# Altium schematic sheet LDO.SchDoc
size 381 x 241 mm; SheetNumber: 2; SheetTotal: 6
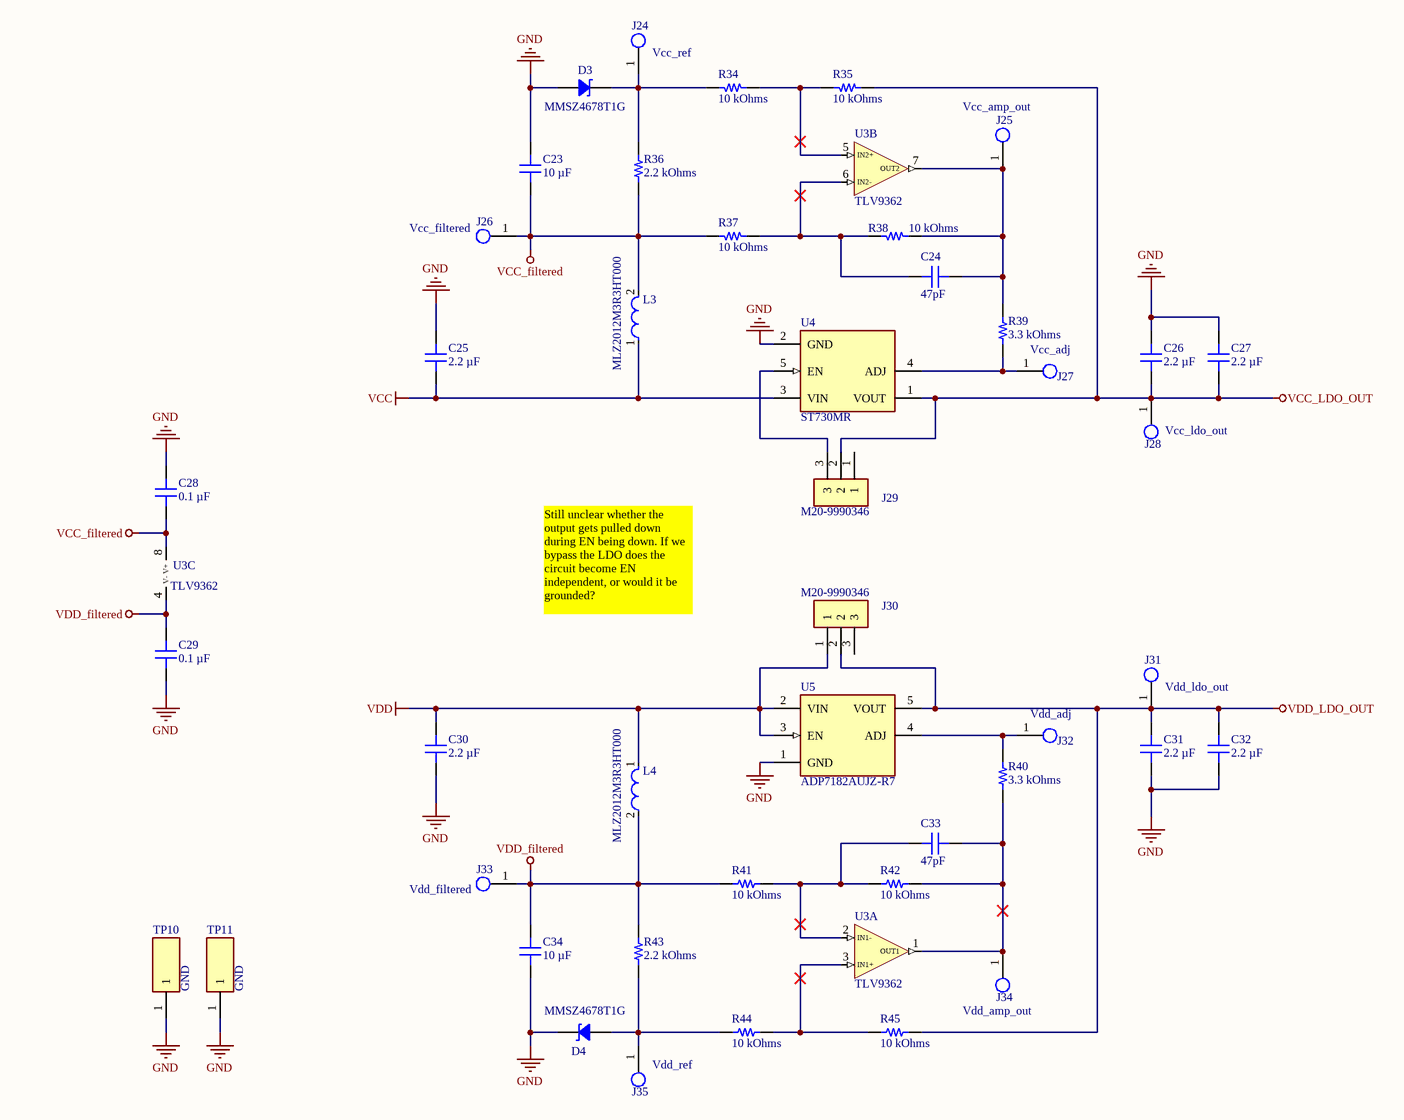
[diagram p0: LDO.SchDoc]

## Parts
C23  10 µF  [CAP 1206_3216 - 0.8MM]
C24  47pF  [CAP 1206_3216 - 1.8MM]
C25  2.2 µF  [CAP 1206_3216 - 0.8MM]
C26  2.2 µF  [CAP 1206_3216 - 0.8MM]
C27  2.2 µF  [CAP 1206_3216 - 0.8MM]
C28  0.1 µF  [CAP 1206_3216 - 0.8MM]
C29  0.1 µF  [CAP 1206_3216 - 0.8MM]
C30  2.2 µF  [CAP 1206_3216 - 0.8MM]
C31  2.2 µF  [CAP 1206_3216 - 0.8MM]
C32  2.2 µF  [CAP 1206_3216 - 0.8MM]
C33  47pF  [CAP 1206_3216 - 1.8MM]
C34  10 µF  [CAP 1206_3216 - 0.8MM]
D3  MMSZ4678T1G  [SOD3716X135N]
D4  MMSZ4678T1G  [SOD3716X135N]
J24  Vcc_ref  [FP-5001-MFG]
J25  Vcc_amp_out  [FP-5001-MFG]
J26  Vcc_filtered  [FP-5001-MFG]
J27  Vcc_adj  [FP-5001-MFG]
J28  Vcc_ldo_out  [FP-5001-MFG]
J29  M20-9990346  [HDRV3W64P0X254_1X3_762X254X864P - duplicate]
J30  M20-9990346  [HDRV3W64P0X254_1X3_762X254X864P - duplicate]
J31  Vdd_ldo_out  [FP-5001-MFG]
J32  Vdd_adj  [FP-5001-MFG]
J33  Vdd_filtered  [FP-5001-MFG]
J34  Vdd_amp_out  [FP-5001-MFG]
J35  Vdd_ref  [FP-5001-MFG]
L3  MLZ2012M3R3HT000  [FP-MLZ2012-1_25-IPC_B]
L4  MLZ2012M3R3HT000  [FP-MLZ2012-1_25-IPC_B]
R34  10 kOhms  [YAGEO RES 1206_3216]
R35  10 kOhms  [YAGEO RES 1206_3216]
R36  2.2 kOhms  [YAGEO RES 1206_3216]
R37  10 kOhms  [YAGEO RES 1206_3216]
R38  10 kOhms  [YAGEO RES 1206_3216]
R39  3.3 kOhms  [YAGEO RES 1206_3216]
R40  3.3 kOhms  [YAGEO RES 1206_3216]
R41  10 kOhms  [YAGEO RES 1206_3216]
R42  10 kOhms  [YAGEO RES 1206_3216]
R43  2.2 kOhms  [YAGEO RES 1206_3216]
R44  10 kOhms  [YAGEO RES 1206_3216]
R45  10 kOhms  [YAGEO RES 1206_3216]
TP10  GND  [S175146R]
TP11  GND  [S175146R]
U3  TLV9362  [SOIC8-127P600X175-8N]  (parts A,B,C of 3)
U4  ST730MR  [FP-UJ-5-IPC_B]
U5  ADP7182AUJZ-R7  [FP-UJ-5-IPC_B]

## Nets
GND: C23.1 C25.1 C26.1 C27.1 C28.2 C29.1 C30.1 C31.1 C32.1 C34.1 D3.1 D4.2 TP10.1 TP11.1 U4.2(GND) U5.1(GND)
VCC: C25.2 L3.1 U4.3(VIN)
VCC_filtered: C23.2 C28.1 J26.1 L3.2 R36.1 R37.2 U3.8(V+)
VCC_LDO_OUT: C26.2 C27.2 J28.1 J29.2 R35.1 U4.1(VOUT)
VDD: C30.2 J30.1 L4.1 U5.2(VIN) U5.3(EN)
VDD_filtered: C29.2 C34.2 J33.1 L4.2 R41.2 R43.2 U3.4(V-)
VDD_LDO_OUT: C31.2 C32.2 J30.2 J31.1 R45.1 U5.5(VOUT)
NetC24_1: C24.1 R37.1 R38.2 U3.6(IN2-)
NetC24_2: C24.2 J25.1 R38.1 R39.1 U3.7(OUT2)
NetC33_1: C33.1 R41.1 R42.2 U3.2(IN1-)
NetC33_2: C33.2 J34.1 R40.2 R42.1 U3.1(OUT1)
NetD3_2: D3.2 J24.1 R34.2 R36.2
NetD4_1: D4.1 J35.1 R43.1 R44.2
NetJ27_1: J27.1 R39.2 U4.4(ADJ)
NetJ29_3: J29.3 U4.5(EN)
NetJ32_1: J32.1 R40.1 U5.4(ADJ)
NetR34_1: R34.1 R35.2 U3.5(IN2+)
NetR44_1: R44.1 R45.2 U3.3(IN1+)

Not connected (* = marked no-connect by the designer): J29 1; J30 3

## Notes on the sheet
- Still unclear whether the output gets pulled down during EN being down. If we bypass the LDO does the circuit become EN independent, or would it be grounded?
- Type @ to refer to a designator or a net

## Library data of the parts
C23 C34 = 885012208069: CAP CER 10UF 25V X7R 1206; manufacturer: Würth Elektronik; Tolerance: ±10%; Part Number: 885012208069; Capacitance: 10 µF; Applications: General Purpose; componentlink1description: Datasheet; componentlink1url: https://katalog.we-online.de/pbs/datasheet/885012208069.pdf; componentlink2description: DigiKey Link; componentlink2url: https://www.digikey.com/en/products/detail/würth-elektronik/885012208069/5453429; Device Package: 1206 (3216 Metric); lastupdated: 6/4/2024 19:10:32; Lifecycle Status: Active; Minimum Order: 1; Mounting Type: Surface Mount, MLCC; Operating Temperature: -55°C ~ 125°C; Package / Case: 1206 (3216 Metric); packaging: TapeAndReel; partid: 43199; Part Status: Active; price: 0.40; series: WCAP-CSGP; Size / Dimension: 0.126" L x 0.063" W (3.20mm x 1.60mm); Supplier 1: DigiKey; Supplier Part Number 1: 732-7574-1-ND; Temperature Coefficient: X7R; Thickness (Max): 0.075" (1.90mm); value: 10 µF; Voltage - Rated: 25V
C24 C33 = 1206AA470KAT1A: CAP CER 47PF 1KV C0G/NP0 1206; manufacturer: AVX Corporation; Temperature Coefficient: C0G, NP0; Tolerance: ±10%; Voltage - Rated: 1000V (1kV); Part Number: 1206AA470KAT1A; Capacitance: 47pF; Applications: General Purpose; componentlink1description: Datasheet; componentlink1url: http://datasheets.avx.com/AVX-HV_MLCC.pdf; componentlink2description: DigiKey Link; componentlink2url: http://digikey.com/product-detail/en/avx-corporation/1206AA470KAT1A/478-2949-1-ND/808148; Device Package: 1206 (3216 Metric); Features: High Voltage; lastupdated: 9/2/2020 01:05:31; Lifecycle Status: Active; Minimum Order: 1; Mounting Type: Surface Mount, MLCC; Operating Temperature: -55°C ~ 125°C; Package / Case: 1206 (3216 Metric); packaging: TapeAndReel; partid: 21825; Part Status: Active; price: 0.11; series: -; Size / Dimension: 0.130" L x 0.063" W (3.30mm x 1.60mm); Supplier 1: DigiKey; Supplier Part Number 1: 478-2949-1-ND; Thickness (Max): 0.071" (1.80mm); value: 47pF
C25-C27 C30-C32 = 885382208001: CAP CER 2.2UF 25V X7R 1206; manufacturer: Würth Elektronik; Tolerance: ±10%; Part Number: 885382208001; Capacitance: 2.2 µF; Applications: Boardflex Sensitive; componentlink2description: DigiKey Link; componentlink2url: https://www.digikey.com/en/products/detail/würth-elektronik/885382208001/9816354; Device Package: 1206 (3216 Metric); Features: Soft Termination; lastupdated: 6/4/2024 19:10:38; Lifecycle Status: Active; Minimum Order: 1; Mounting Type: Surface Mount, MLCC; Operating Temperature: -55°C ~ 125°C; Package / Case: 1206 (3216 Metric); packaging: TapeAndReel; partid: 45904; Part Status: Active; price: 0.35; series: WCAP-CSST; Size / Dimension: 0.126" L x 0.063" W (3.20mm x 1.60mm); Supplier 1: DigiKey; Supplier Part Number 1: 732-13199-1-ND; Temperature Coefficient: X7R; Thickness (Max): 0.083" (2.10mm); value: 2.2 µF; Voltage - Rated: 25V
C28 C29 = 885012208087: CAP CER 0.1UF 50V X7R 1206; manufacturer: Würth Elektronik; Tolerance: ±10%; Part Number: 885012208087; Capacitance: 0.1 µF; Applications: General Purpose; componentlink1description: Datasheet; componentlink1url: https://katalog.we-online.de/pbs/datasheet/885012208087.pdf; componentlink2description: DigiKey Link; componentlink2url: https://www.digikey.com/en/products/detail/würth-elektronik/885012208087/5453982; Device Package: 1206 (3216 Metric); lastupdated: 6/4/2024 19:10:27; Lifecycle Status: Active; Minimum Order: 1; Mounting Type: Surface Mount, MLCC; Operating Temperature: -55°C ~ 125°C; Package / Case: 1206 (3216 Metric); packaging: TapeAndReel; partid: 20879; Part Status: Active; price: 0.06; series: WCAP-CSGP; Size / Dimension: 0.126" L x 0.063" W (3.20mm x 1.60mm); Supplier 1: DigiKey; Supplier Part Number 1: 732-8127-1-ND; Temperature Coefficient: X7R; Thickness (Max): 0.035" (0.90mm); value: 0.1 µF; Voltage - Rated: 50V
D3 D4 = MMSZ4678T1G: Zener Diode; Manufacturer_Name: onsemi; Datasheet Link: http://www.onsemi.com/pub/Collateral/MMSZ4678T1-D.PDF; Height: 1.35mm; Manufacturer_Part_Number: MMSZ4678T1G; Mouser Part Number: 863-MMSZ4678T1G; Mouser Price/Stock: https://www.mouser.co.uk/ProductDetail/onsemi/MMSZ4678T1G?qs=P4IOph%252Bbot8vK8FZ3ltvyA%3D%3D; Arrow Part Number: MMSZ4678T1G; Arrow Price/Stock: https://www.arrow.com/en/products/mmsz4678t1g/on-semiconductor?utm_currency=USD&region=europe
J24-J28 J31-J35 = 5001: PC TEST POINT MINIATURE BLACK; Body Material: Bronze; Plating: Silver; Inside Diameter: 1.27mm; Hole Diameter: 1.6mm; Number of Ports: 1; Outside Diameter: 2.54mm; Insulation: Insulated; Insulation Material: Nylon; Mount: Through Hole; RoHS Compliant: Yes; Series: THM; Height: 0.3inch; Termination: Through Hole; Material: Nylon; Packaging: Bulk; Contact Material: Bronze; REACH SVHC: No SVHC; Contact Plating: Silver; Orientation: Straight; Lead Free: Lead Free; Package Quantity: 100; Length: 7.62mm; Flammability Rating: UL94 V-0; Number of Contacts: 1; Diameter: 2.54mm; Housing Color: Black; Color: Black; Supplier 1: Mouser; Supplier Part Number 1: 534-5001
J29 J30 = M20-9990346: Connector; Manufacturer_Name: Harwin; Datasheet Link: https://cdn.harwin.com/pdfs/M20-999.pdf; Height: 8.64mm; Manufacturer_Part_Number: M20-9990346; Mouser Part Number: 855-M20-9990346; Mouser Price/Stock: https://www.mouser.co.uk/ProductDetail/Harwin/M20-9990346?qs=ulE8k0yEMYbyhQ3uXpFs8Q%3D%3D
L3 L4 = MLZ2012M3R3HT000: Shielded Multilayer Inductor 3.3uH ±20% 500mA 260mΩ SMD 0805; Saturation Current: 350mA; Core Material: Ferrite; DC Resistance (DCR): 260mR; RoHS Compliant: Yes; Mount: Surface Mount; Case Code (Metric): 2012; Case/Package: 0805; Min Operating Temperature: -55°C; Package Quantity: 2000; Shielding: Shielded; Current Rating: 500mA; Height - Seated (Max): 0.057inch; Case Code (Imperial): 0805; Width: 0.049inch; Tolerance: 20%; Packaging: Tape and Reel; Inductance: 3.3uH; Lead Free: Lead Free; Max Operating Temperature: 125°C; Length: 0.079inch; Value: 3.3uH
R34 R35 R37 R38 R41 R42 R44 R45 = RT1206FRE0710KL: RES SMD 10K OHM 1% 1/4W 1206; Manufacturer: Yageo; Power (Watts): 0.25W, 1/4W; Temperature Coefficient: ±50ppm/°C; Part Number: RT1206FRE0710KL; ComponentLink1Description: Datasheet; ComponentLink1URL: https://www.yageo.com/upload/media/product/productsearch/datasheet/rchip/PYu-RT_1-to-0.01_RoHS_L_11.pdf; ComponentLink2Description: DigiKey Link; ComponentLink2URL: https://www.digikey.com/en/products/detail/yageo/RT1206FRE0710KL/1082868; Composition: Thin Film; Device Package: 1206 (3216 Metric); Height - Seated (Max): 0.026" (0.65mm); LastUpdated: 7/25/2024 09:21:28; Lifecycle Status: Active; Minimum Order: 1; Number of Terminations: 2; Operating Temperature: -55°C ~ 155°C; Package / Case: 1206 (3216 Metric); Packaging: TapeAndReel; PartId: 38903; Part Status: Active; Price: 0.01; Resistance: 10 kOhms; Series: RT; Size / Dimension: 0.122" L x 0.063" W (3.10mm x 1.60mm); Supplier 1: DigiKey; Supplier Part Number 1: YAG1242CT-ND; Supplier Device Package: 1206; Tolerance: ±1%; Value: 10 kOhms
R36 R43 = RT1206FRE072K2L: RES SMD 2.2K OHM 1% 1/4W 1206; Manufacturer: Yageo; Power (Watts): 0.25W, 1/4W; Temperature Coefficient: ±50ppm/°C; Part Number: RT1206FRE072K2L; ComponentLink1Description: Datasheet; ComponentLink1URL: https://www.yageo.com/upload/media/product/productsearch/datasheet/rchip/PYu-RT_1-to-0.01_RoHS_L_12.pdf; ComponentLink2Description: DigiKey Link; ComponentLink2URL: https://www.digikey.com/en/products/detail/yageo/RT1206FRE072K2L/1083103; Composition: Thin Film; Device Package: 1206 (3216 Metric); Height - Seated (Max): 0.026" (0.65mm); LastUpdated: 7/25/2024 09:21:22; Lifecycle Status: Active; Minimum Order: 1; Number of Terminations: 2; Operating Temperature: -55°C ~ 155°C; Package / Case: 1206 (3216 Metric); Packaging: TapeAndReel; PartId: 58391; Part Status: Active; Price: 0.01; Resistance: 2.2 kOhms; Series: RT; Size / Dimension: 0.122" L x 0.063" W (3.10mm x 1.60mm); Supplier 1: DigiKey; Supplier Part Number 1: 13-RT1206FRE072K2LCT-ND; Supplier Device Package: 1206; Tolerance: ±1%; Value: 2.2 kOhms
R39 R40 = RT1206FRE073K3L: RES SMD 3.3K OHM 1% 1/4W 1206; Manufacturer: Yageo; Power (Watts): 0.25W, 1/4W; Temperature Coefficient: ±50ppm/°C; Part Number: RT1206FRE073K3L; ComponentLink1Description: Datasheet; ComponentLink1URL: https://www.yageo.com/upload/media/product/productsearch/datasheet/rchip/PYu-RT_1-to-0.01_RoHS_L_12.pdf; ComponentLink2Description: DigiKey Link; ComponentLink2URL: https://www.digikey.com/en/products/detail/yageo/RT1206FRE073K3L/1083187; Composition: Thin Film; Device Package: 1206 (3216 Metric); Height - Seated (Max): 0.026" (0.65mm); LastUpdated: 7/25/2024 09:21:22; Lifecycle Status: Active; Minimum Order: 1; Number of Terminations: 2; Operating Temperature: -55°C ~ 155°C; Package / Case: 1206 (3216 Metric); Packaging: TapeAndReel; PartId: 58380; Price: 0.01; Resistance: 3.3 kOhms; Series: RT; Size / Dimension: 0.122" L x 0.063" W (3.10mm x 1.60mm); Supplier 1: DigiKey; Supplier Part Number 1: 13-RT1206FRE073K3LCT-ND; Supplier Device Package: 1206; Tolerance: ±1%; Value: 3.3 kOhms; Part Status: Active
TP10 TP11 = S1751-46R: Test Point; Manufacturer_Name: Harwin; Datasheet Link: https://cdn.harwin.com/pdfs/S1751R.pdf; Height: 2mm; Manufacturer_Part_Number: S1751-46R; Mouser Part Number: 855-S1751-46R; Mouser Price/Stock: https://www.mouser.co.uk/ProductDetail/Harwin/S1751-46R?qs=l6ZPVqNVZb71wETAKrfRig%3D%3D
U3 = TLV9362: TLV936x 10-MHz, 40-V, RRO, Operational Amplifie; ComponentLink1Description: Datasheet; ComponentLink1URL: https://www.ti.com/lit/ds/symlink/tlv9362.pdf
U5 = ADP7182: IC REG LIN NEG ADJ 200MA 5TSOT; Manufacturer: Analog Devices; Number Of Outputs: 1; Min Supply Voltage: -2.7V; Max Junction Temp: +125°C; Dropout Voltage: -185mV; Output Current: -200mA; Max Supply Voltage: -28V; Output Voltage: -1.22/-27.815V; Nominal Supply Current: -33/-650uA; Output Type: AdjustableProgrammable; Accuracy Percentage: 1%; RoHS: TRUE; Ambient Temperature Range Low: -40°C; Digikey Description: IC REG LIN NEG ADJ 200MA 5TSOT; Device Class L3: Voltage Regulators - Linear; Ambient Temperature Range High: +85°C; Manufacturer Part Number: ADP7182AUJZ-R7; ComponentLink2URL: https://www.analog.com/media/en/technical-documentation/data-sheets/ADP7182.pdf; Ipc Land Pattern Name: SOT95P280X100-5; Temperature Range Low: -40°C; ComponentLink2Description: Datasheet; Mouser Description: LDO Regulator Neg -1.22V to -27V 0.2A 5-Pin TSOT T/R; Category: IC; Automotive: No; Device Class L1: Integrated Circuits (ICs); Temperature: -40°C to +125°C; Octopart: https://octopart.com/adp7182aujz-r7-analog+devices-21054665; Device Class L2: Power Management ICs; Height: 1mm; Package: UJ-5; Temperature Range High: +125°C; Lead Free: Yes